# EAGLE design adapter (EAGLE 5.10)
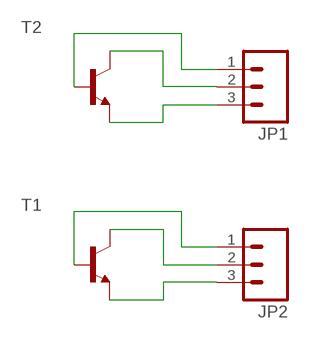
[diagram p0: schematic, sheet 1]

## Parts
JP1  M03PTH  [1X03]
JP2  M03PTH  [1X03]
T1  -NPN-SOT23-EBC  [SOT23-EBC]
T2  -NPN-SOT23-EBC  [SOT23-EBC]

## Nets
N$1: JP2.2 T1.C
N$2: JP2.3 T1.E
N$3: JP2.1 T1.B
N$4: JP1.3 T2.E
N$5: JP1.2 T2.C
N$6: JP1.1 T2.B

## Library data of the parts
JP1 JP2 = SparkFun:M03: Header 3 Standard 3-pin 0.1" header. Use with straight break away headers (SKU : PRT-00116), right angle break away headers (PRT-00553), swiss pins (PRT-00743), machine pins (PRT-00117), and female headers (PRT-00115). Molex polarized connector foot print use with SKU : PRT-08232 with associated crimp pins and housings.
T1 T2 = transistor:*-NPN-: NPN Transistror BF959 corrected 2008.03.06

## Board
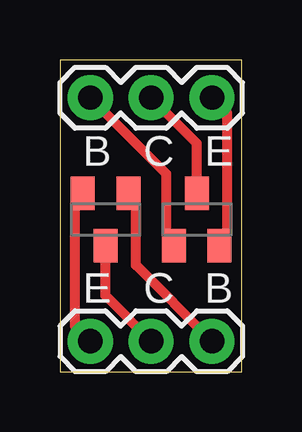
[diagram p1: board, top side]

Size 7.6 x 13.01 mm. Coordinates in mm from the lower left corner, seen from the top.
Outline: 0,0 7.6,0 7.6,13.01 0,13.01 0,0
Copper layers (1*16): Top 0.035mm / dielectric 1.5mm / Bottom 0.035mm
Design rules "default": minimum track width 10mil, minimum drill 24mil, track to track 8mil, track to pad 8mil, pad to pad 8mil, via to via 8mil, smd to smd 8mil, copper to edge 40mil, drill to drill 8mil, minimum pad ring 10mil, minimum via ring 8mil, stop-mask expansion 4mil, vias tented up to drill 0mil, thermal gap 10mil

### Footprints (pad centres in the part's own frame; a part is rotated, then mirrored left to right if it is on the bottom)
1X03 = drill 1.016 pad 1.88 round: 1 0,0; 2 2.54,0; 3 5.08,0
SOT23-EBC = smd 1 x 1.4: B 0.95,-1.1; C 0,1.1; E -0.95,-1.1

### Placement (x,y rotation side)
JP1  6.35,11.43 180 top
JP2  1.27,1.27 0 top
T1  1.91,6.35 180 top
T2  5.71,6.35 0 top

### Tracks (layer width: path | path; a pad name or v marks a point on that pad's centre or on a via)
N$1
  Top 0.406: T1.C 1.91,3.17 JP2.2
N$2
  Top 0.406: T1.E 2.85,7.3 3.17,6.99 3.17,4.45 JP2.3
N$3
  Top 0.406: T1.B 0.95,7.3 0.64,6.99 0.64,1.91 JP2.1
N$4
  Top 0.406: T2.E 4.76,5.39 4.45,5.71 4.45,8.26 JP1.3
N$5
  Top 0.406: T2.C 5.71,9.53 JP1.2
N$6
  Top 0.406: T2.B 6.67,5.39 6.99,5.71 6.99,10.79 JP1.1

### Text on the board
tNames: B | C | E | E | C | B